# Altium schematic sheet Debug.SchDoc
size 431 x 279 mm; SheetNumber: 13; SheetTotal: 14
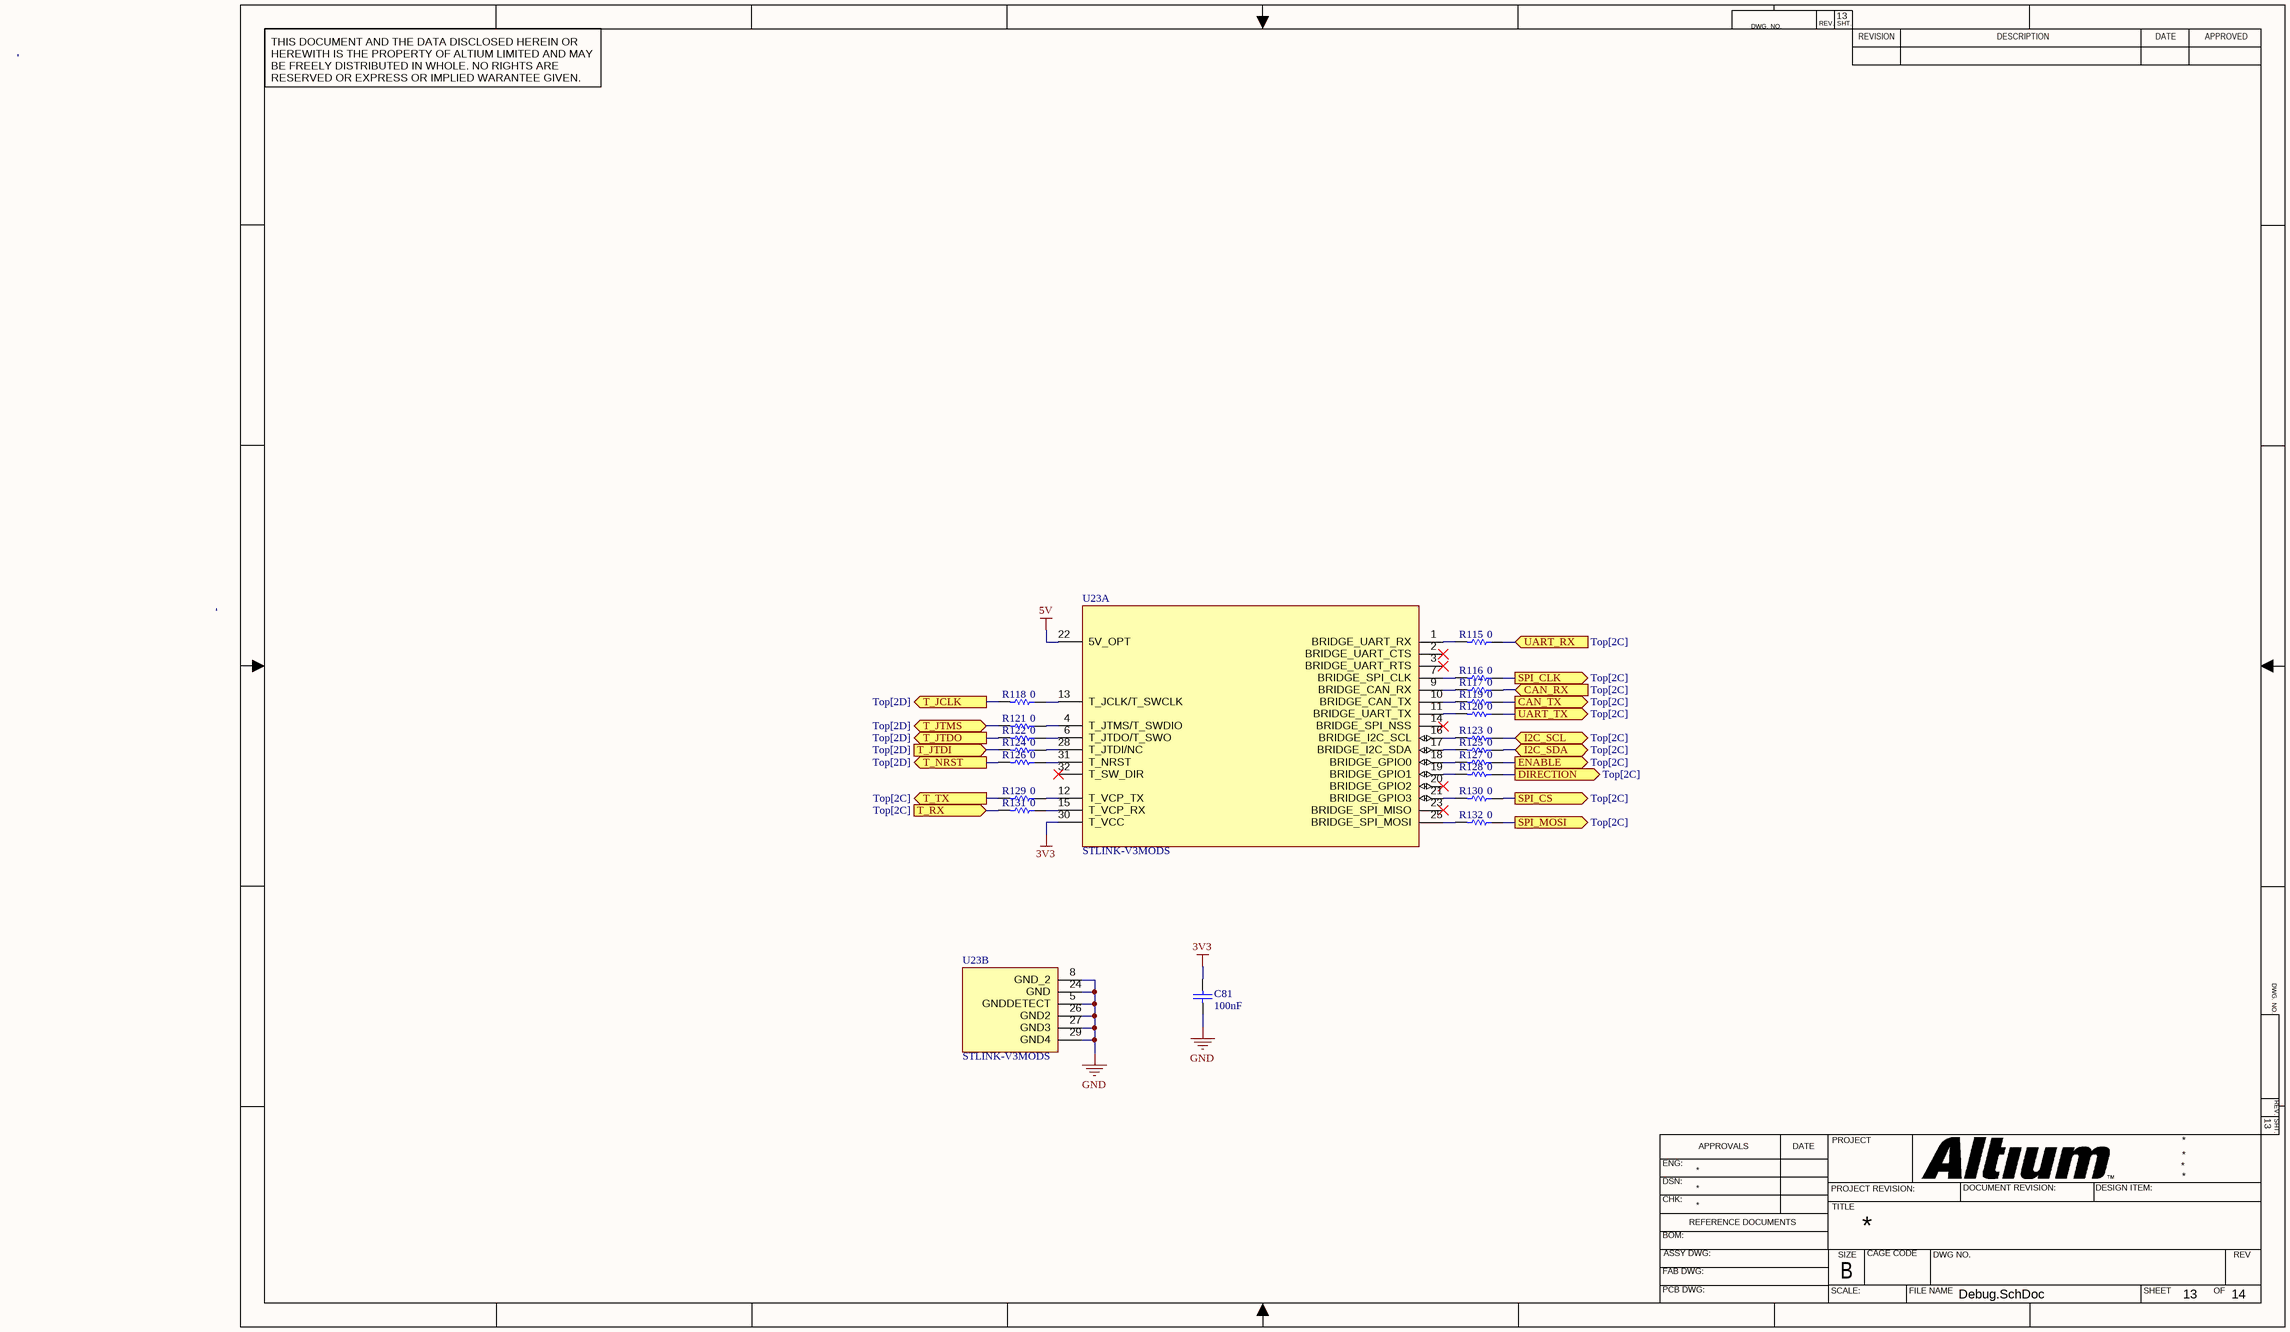
[diagram p0: Debug.SchDoc]

## Parts
C81  value 100nF  (hidden comment: Capacitor)
R115  value 0  (hidden comment: Resistor)
R116  value 0  (hidden comment: Resistor)
R117  value 0  (hidden comment: Resistor)
R118  value 0  (hidden comment: Resistor)
R119  value 0  (hidden comment: Resistor)
R120  value 0  (hidden comment: Resistor)
R121  value 0  (hidden comment: Resistor)
R122  value 0  (hidden comment: Resistor)
R123  value 0  (hidden comment: Resistor)
R124  value 0  (hidden comment: Resistor)
R125  value 0  (hidden comment: Resistor)
R126  value 0  (hidden comment: Resistor)
R127  value 0  (hidden comment: Resistor)
R128  value 0  (hidden comment: Resistor)
R129  value 0  (hidden comment: Resistor)
R130  value 0  (hidden comment: Resistor)
R131  value 0  (hidden comment: Resistor)
R132  value 0  (hidden comment: Resistor)
U23  STLINK-V3MODS  [MODULE_STLINK-V3MODS]  (parts A,B of 2)

## Ports
CAN_RX (in, see Top[2C]), CAN_TX (out, see Top[2C]), DIRECTION (out, see Top[2C]), ENABLE (out, see Top[2C]), I2C_SCL (bidir, see Top[2C]), I2C_SDA (bidir, see Top[2C]), SPI_CLK (out, see Top[2C]), SPI_CS (out, see Top[2C]), SPI_MOSI (out, see Top[2C]), T_JCLK (out, see Top[2D]), T_JTDI (in, see Top[2D]), T_JTDO (out, see Top[2D]), T_JTMS (bidir, see Top[2D]), T_NRST (out, see Top[2D]), T_RX (in, see Top[2C]), T_TX (out, see Top[2C]), UART_RX (in, see Top[2C]), UART_TX (out, see Top[2C])

## Nets
3V3: C81.2 U23.30(T_VCC)
5V: U23.22(5V_OPT)
GND: C81.1 U23.5(GNDDETECT) U23.8(GND_2) U23.24(GND) U23.26(GND2) U23.27(GND3) U23.29(GND4)
CAN_RX: R117.1 ; port CAN_RX
CAN_TX: R119.1 ; port CAN_TX
DIRECTION: R128.1 ; port DIRECTION
ENABLE: R127.1 ; port ENABLE
I2C_SCL: R123.1 ; port I2C_SCL
I2C_SDA: R125.1 ; port I2C_SDA
SPI_CLK: R116.1 ; port SPI_CLK
SPI_CS: R130.1 ; port SPI_CS
SPI_MOSI: R132.1 ; port SPI_MOSI
T_JCLK: R118.2 ; port T_JCLK
T_JTDI: R124.2 ; port T_JTDI
T_JTDO: R122.2 ; port T_JTDO
T_JTMS: R121.2 ; port T_JTMS
T_NRST: R126.2 ; port T_NRST
T_RX: R131.2 ; port T_RX
T_TX: R129.2 ; port T_TX
UART_RX: R115.1 ; port UART_RX
UART_TX: R120.1 ; port UART_TX
NetR115_2: R115.2 U23.1(BRIDGE_UART_RX)
NetR116_2: R116.2 U23.7(BRIDGE_SPI_CLK)
NetR117_2: R117.2 U23.9(BRIDGE_CAN_RX)
NetR118_1: R118.1 U23.13(T_JCLK/T_SWCLK)
NetR119_2: R119.2 U23.10(BRIDGE_CAN_TX)
NetR120_2: R120.2 U23.11(BRIDGE_UART_TX)
NetR121_1: R121.1 U23.4(T_JTMS/T_SWDIO)
NetR122_1: R122.1 U23.6(T_JTDO/T_SWO)
NetR123_2: R123.2 U23.16(BRIDGE_I2C_SCL)
NetR124_1: R124.1 U23.28(T_JTDI/NC)
NetR125_2: R125.2 U23.17(BRIDGE_I2C_SDA)
NetR126_1: R126.1 U23.31(T_NRST)
NetR127_2: R127.2 U23.18(BRIDGE_GPIO0)
NetR128_2: R128.2 U23.19(BRIDGE_GPIO1)
NetR129_1: R129.1 U23.12(T_VCP_TX)
NetR130_2: R130.2 U23.21(BRIDGE_GPIO3)
NetR131_1: R131.1 U23.15(T_VCP_RX)
NetR132_2: R132.2 U23.25(BRIDGE_SPI_MOSI)

Not connected (* = marked no-connect by the designer): U23 2(BRIDGE_UART_CTS)* 3(BRIDGE_UART_RTS)* 14(BRIDGE_SPI_NSS)* 20(BRIDGE_GPIO2)* 23(BRIDGE_SPI_MISO)* 32(T_SW_DIR)*

## Notes on the sheet
- DWG. NO.
- REV.
- SHT.
- THIS DOCUMENT AND THE DATA DISCLOSED HEREIN OR HEREWITH IS THE PROPERTY OF ALTIUM LIMITED AND MAY BE FREELY DISTRIBUTED IN WHOLE. NO RIGHTS ARE RESERVED OR EXPRESS OR IMPLIED WARANTEE GIVEN.
- REVISION
- DESCRIPTION
- DATE
- APPROVED
- ENG:
- APPROVALS
- PROJECT
- DSN:
- CHK:
- REFERENCE DOCUMENTS
- PROJECT REVISION:
- TITLE
- DOCUMENT REVISION:
- DESIGN ITEM:
- BOM:
- FAB DWG:
- PCB DWG:
- ASSY DWG:
- SCALE:
- SIZE
- B
- CAGE CODE
- FILE NAME
- DWG NO.
- SHEET
- OF
- REV

## Library data of the parts
C81 = Capacitor: SimulationGenericComponent: True; Supplier 1: Arrow Electronics
R115-R132 = Resistor: SimulationGenericComponent: True; TC1: 0; TC2: 0; Supplier 1: Digi-Key; Supplier Part Number 1: P0.0GCT-ND
U23 = CMP-003-000000-1: Price: None; MP: STLINK-V3MODS; Design Item ID: STLINK-V3MODS; Value: *; Availability: Unavailable; Component Type: Standard; Package: None; Source: STLINK-V3MODS.SchLib; Pin Count: 32